# EAGLE design rpi_display_v2 (EAGLE 7.6.0)

## Sheet 1 of 2
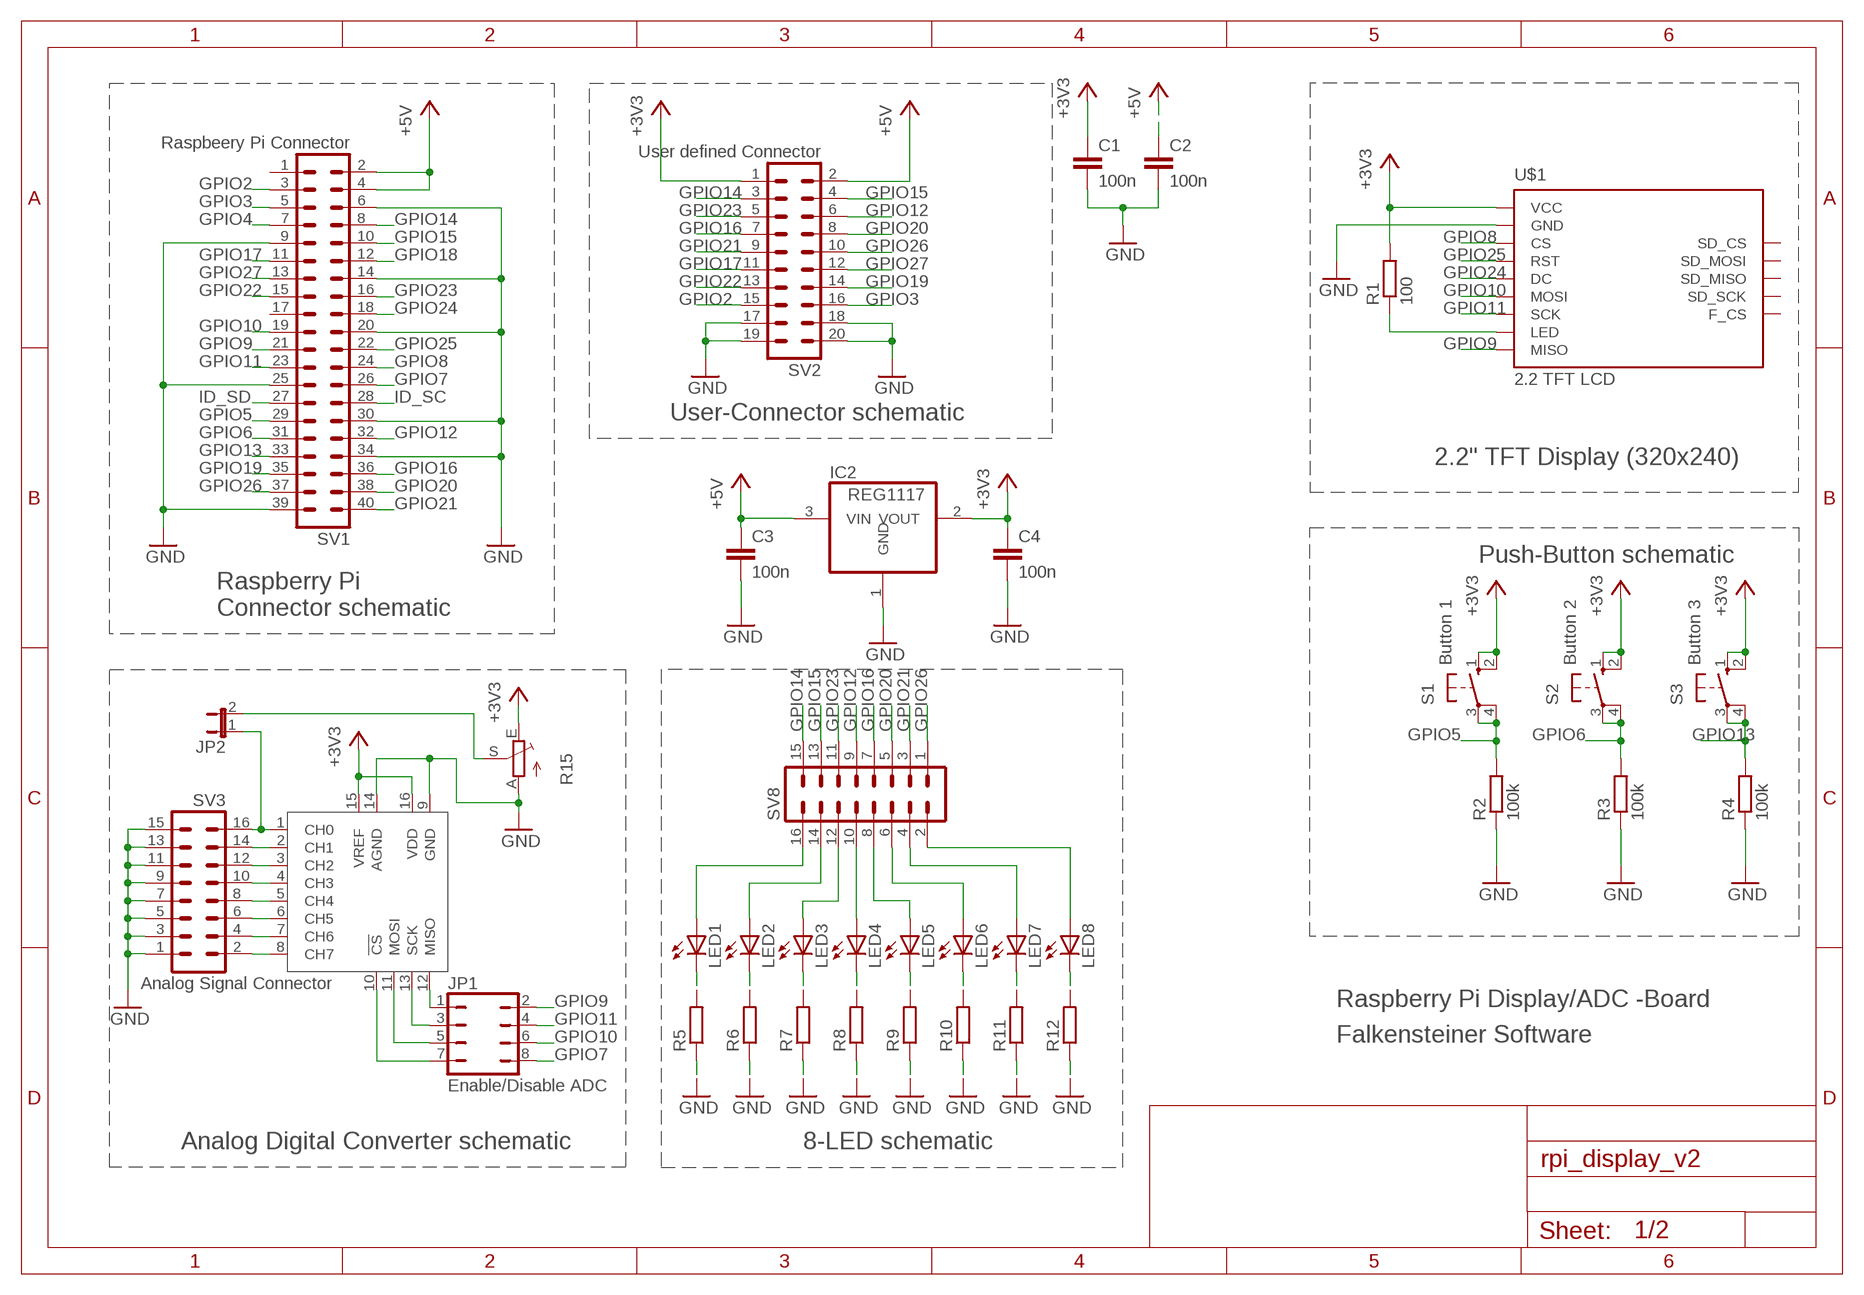
[diagram p0: schematic, sheet 1]

### Parts
C1  100n  C-EUC1206  [C1206]
C2  100n  C-EUC1206  [C1206]
C3  100n  C-EUC1206  [C1206]
C4  100n  C-EUC1206  [C1206]
IC1  MCP3008P  [DIL16]
IC2  REG1117  [SOT223]
JP1  Enable/Disable ADC  JP4Q  [JP4Q]
JP2  JP1E  [JP1]
LED1  LEDSML1206  [SML1206]
LED2  LEDSML1206  [SML1206]
LED3  LEDSML1206  [SML1206]
LED4  LEDSML1206  [SML1206]
LED5  LEDSML1206  [SML1206]
LED6  LEDSML1206  [SML1206]
LED7  LEDSML1206  [SML1206]
LED8  LEDSML1206  [SML1206]
R1  100  R-EU_R1206  [R1206]
R2  100k  R-EU_R1206  [R1206]
R3  100k  R-EU_R1206  [R1206]
R4  100k  R-EU_R1206  [R1206]
R5  R-EU_R1206  [R1206]
R6  R-EU_R1206  [R1206]
R7  R-EU_R1206  [R1206]
R8  R-EU_R1206  [R1206]
R9  R-EU_R1206  [R1206]
R10  R-EU_R1206  [R1206]
R11  R-EU_R1206  [R1206]
R12  R-EU_R1206  [R1206]
R15  TRIM_EU-CA6V  [CA6V]
S1  Button 1  10-XX  [B3F-10XX]
S2  Button 2  10-XX  [B3F-10XX]
S3  Button 3  10-XX  [B3F-10XX]
SV1  Raspbeery Pi Connector  MA20-2  [MA20-2]
SV2  User defined Connector  MA10-2  [MA10-2]
SV3  Analog Signal Connector  MA08-2  [MA08-2]
SV8  MA08-2  [MA08-2]
U$1  2.2_TFT_LCD  [2.2_TFT_LCD]

### Nets
+3V3: C1.1 C4.1 IC1.15(VREF) IC1.16(VDD) IC2.2(VOUT) R1.2 R15.E S1.1(S) S1.2(S1) S2.1(S) S2.2(S1) S3.1(S) S3.2(S1) SV2.1 U$1.VCC ; also sheet 2
+5V: C2.1 C3.1 IC2.3(VIN) SV1.2 SV1.4 SV2.2 ; also sheet 2
GND: C1.2 C2.2 C3.2 C4.2 IC1.9(GND) IC1.14(AGND) IC2.1(GND) R2.1 R3.1 R4.1 R5.1 R6.1 R7.1 R8.1 R9.1 R10.1 R11.1 R12.1 R15.A SV1.6 SV1.9 SV1.14 SV1.20 SV1.25 SV1.30 SV1.34 SV1.39 SV2.17 SV2.18 SV2.19 SV2.20 SV3.1 SV3.3 SV3.5 SV3.7 SV3.9 SV3.11 SV3.13 SV3.15 U$1.GND ; also sheet 2
GPIO2: SV1.3 SV2.15
GPIO3: SV1.5 SV2.16
GPIO4: SV1.7 ; also sheet 2
GPIO5: R2.2 S1.3(P) S1.4(P1) SV1.29
GPIO6: R3.2 S2.3(P) S2.4(P1) SV1.31
GPIO7: JP1.8 SV1.26
GPIO8: SV1.24 U$1.CS
GPIO9: JP1.2 SV1.21 U$1.MISO
GPIO10: JP1.6 SV1.19 U$1.MOSI
GPIO11: JP1.4 SV1.23 U$1.SCK
GPIO12: SV1.32 SV2.6 SV8.9
GPIO13: R4.2 S3.3(P) S3.4(P1) SV1.33
GPIO14: SV1.8 SV2.3 SV8.15
GPIO15: SV1.10 SV2.4 SV8.13
GPIO16: SV1.36 SV2.7 SV8.7
GPIO17: SV1.11 SV2.11 ; also sheet 2
GPIO18: SV1.12 ; also sheet 2
GPIO19: SV1.35 SV2.14
GPIO20: SV1.38 SV2.8 SV8.5
GPIO21: SV1.40 SV2.9 SV8.3
GPIO22: SV1.15 SV2.13 ; also sheet 2
GPIO23: SV1.16 SV2.5 SV8.11
GPIO24: SV1.18 U$1.DC
GPIO25: SV1.22 U$1.RST
GPIO26: SV1.37 SV2.10 SV8.1
GPIO27: SV1.13 SV2.12 ; also sheet 2
ID_SC: SV1.28
ID_SD: SV1.27
N$1: R1.1 U$1.LED
N$2: IC1.12(MISO) JP1.1
N$3: IC1.13(SCK) JP1.3
N$4: IC1.11(MOSI) JP1.5
N$5: IC1.10(!CS) JP1.7
N$6: IC1.1(CH0) JP2.1 SV3.16
N$7: IC1.2(CH1) SV3.14
N$8: IC1.3(CH2) SV3.12
N$9: IC1.4(CH3) SV3.10
N$10: IC1.5(CH4) SV3.8
N$11: IC1.6(CH5) SV3.6
N$12: IC1.7(CH6) SV3.4
N$13: IC1.8(CH7) SV3.2
N$14: LED1.A SV8.16
N$15: LED1.C R5.2
N$16: LED2.A SV8.14
N$17: LED2.C R6.2
N$18: LED3.A SV8.12
N$19: LED3.C R7.2
N$20: LED4.A SV8.10
N$21: LED4.C R8.2
N$22: LED5.A SV8.8
N$23: LED5.C R9.2
N$24: LED6.A SV8.6
N$25: LED6.C R10.2
N$26: LED7.A SV8.4
N$27: LED7.C R11.2
N$28: LED8.A SV8.2
N$29: LED8.C R12.2
N$65: JP2.2 R15.S
Unconnected: SV1.1 SV1.17 U$1.F_CS U$1.SD_CS U$1.SD_MISO U$1.SD_MOSI U$1.SD_SCK

### Notes on the sheet
- User-Connector schematic
- 2.2" TFT Display (320x240)
- Push-Button schematic
- Raspberry Pi
  Connector schematic
- Raspberry Pi Display/ADC -Board
- Falkensteiner Software
- Analog Digital Converter schematic | 8-LED schematic

## Sheet 2 of 2
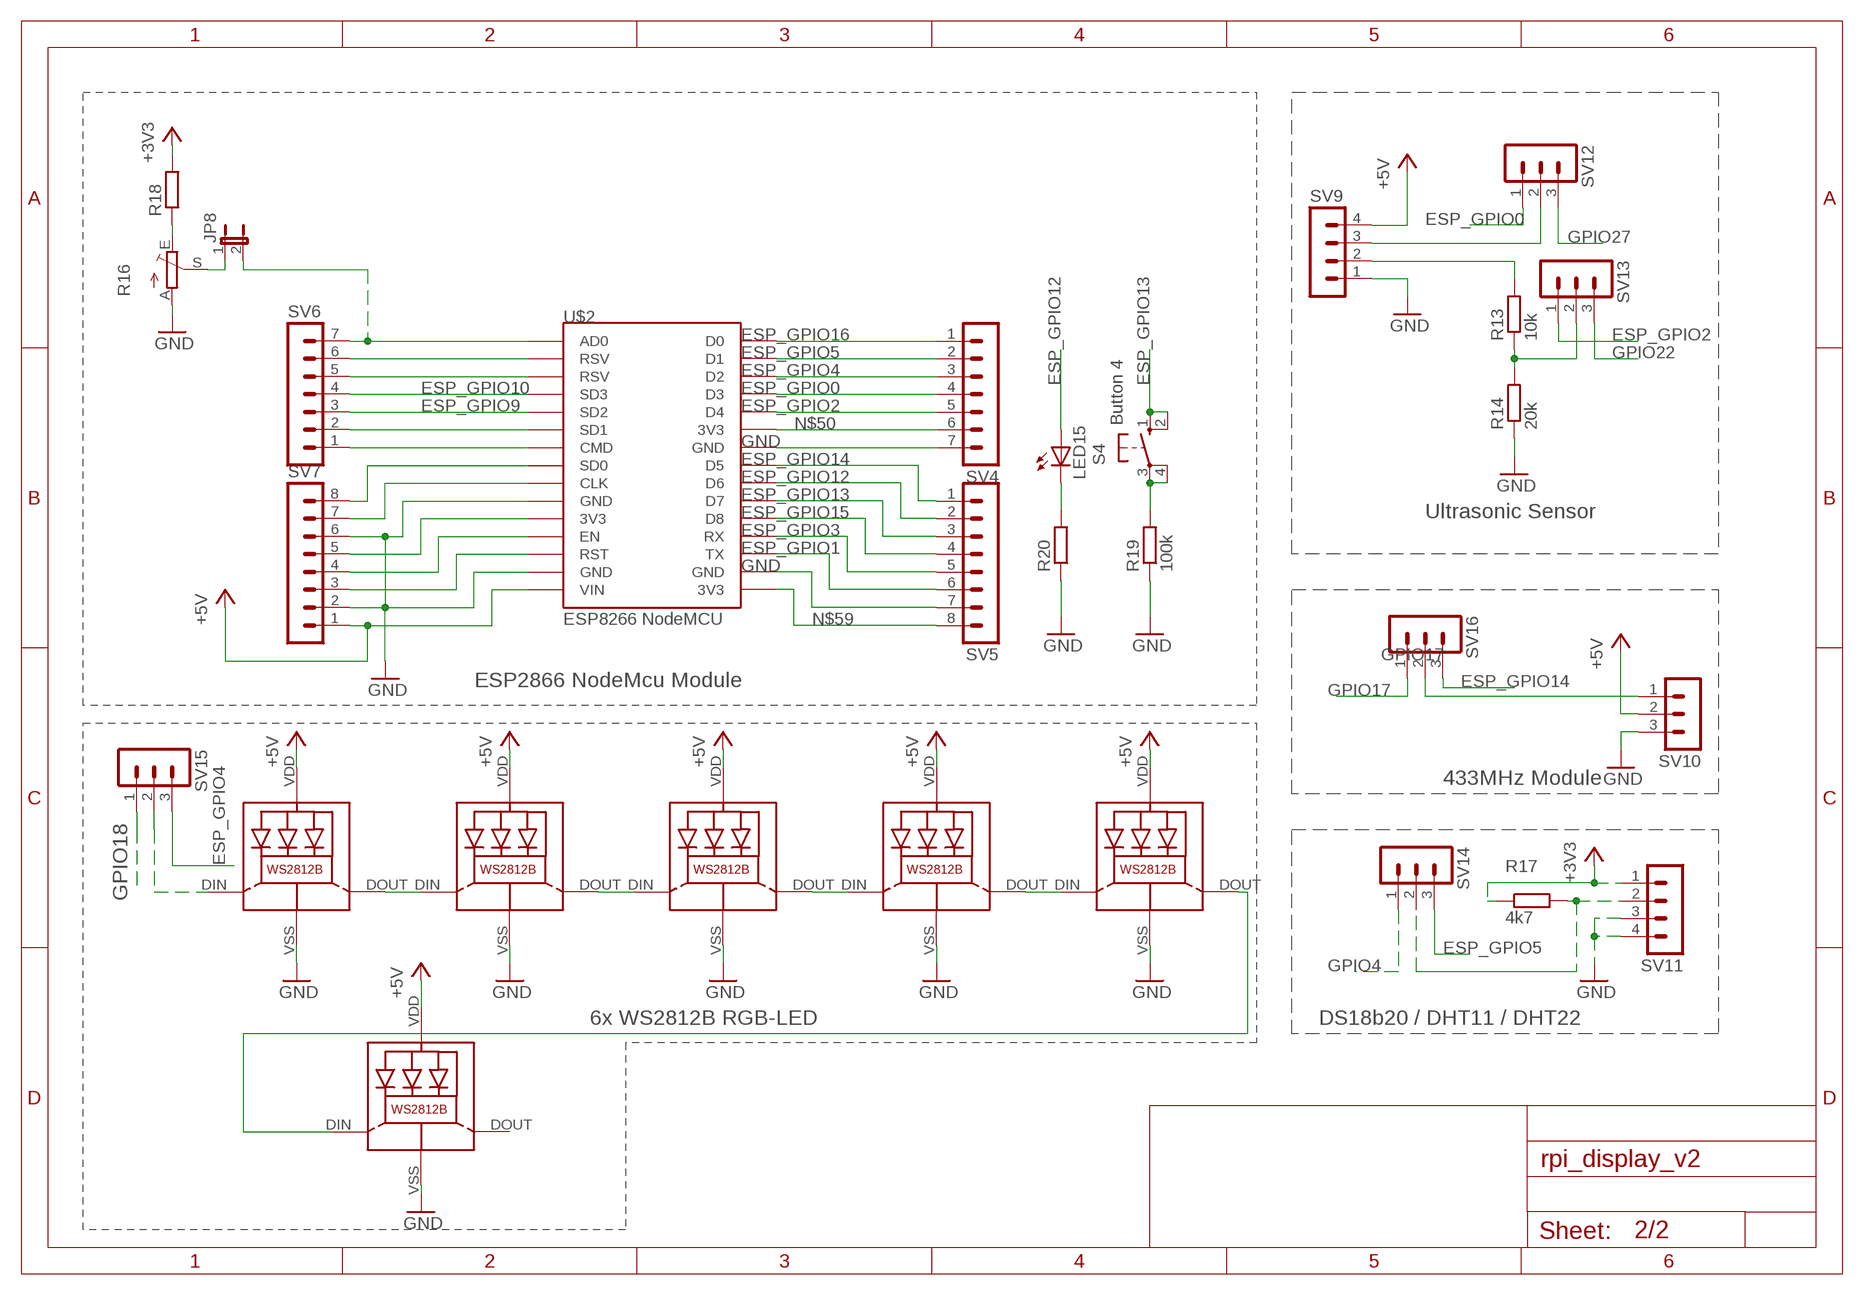
[diagram p1: schematic, sheet 2]

### Parts
JP8  JP1E  [JP1]
LED9  WS2812B  [WS2812B]
LED10  WS2812B  [WS2812B]
LED11  WS2812B  [WS2812B]
LED12  WS2812B  [WS2812B]
LED13  WS2812B  [WS2812B]
LED14  WS2812B  [WS2812B]
LED15  LEDSML1206  [SML1206]
R13  10k  R-EU_R1206  [R1206]
R14  20k  R-EU_R1206  [R1206]
R16  TRIM_EU-CA6V  [CA6V]
R17  4k7  R-EU_R1206  [R1206]
R18  R-EU_R1206  [R1206]
R19  100k  R-EU_R1206  [R1206]
R20  R-EU_R1206  [R1206]
S4  Button 4  10-XX  [B3F-10XX]
SV4  MA07-1  [MA07-1]
SV5  MA08-1  [MA08-1]
SV6  MA07-1  [MA07-1]
SV7  MA08-1  [MA08-1]
SV9  MA04-1  [MA04-1]
SV10  MA03-1  [MA03-1]
SV11  MA04-1  [MA04-1]
SV12  MA03-1  [MA03-1]
SV13  MA03-1  [MA03-1]
SV14  MA03-1  [MA03-1]
SV15  MA03-1  [MA03-1]
SV16  MA03-1  [MA03-1]
U$2  ESP8266 NodeMCU  ESP12E_DEVKIT  [ESP12E_DEVKIT]

### Nets
+3V3: R17.1 R18.2 SV11.1 ; also sheet 1
+5V: LED9.VDD LED10.VDD LED11.VDD LED12.VDD LED13.VDD LED14.VDD SV7.1 SV9.4 SV10.2 U$2.VIN ; also sheet 1
ESP_GPIO0: SV4.4 SV12.1 U$2.D3
ESP_GPIO1: SV5.6 U$2.TX
ESP_GPIO2: SV4.5 SV13.1 U$2.D4
ESP_GPIO3: SV5.5 U$2.RX
ESP_GPIO4: SV4.3 SV15.3 U$2.D2
ESP_GPIO5: SV4.2 SV14.3 U$2.D1
ESP_GPIO9: SV6.3 U$2.SD2
ESP_GPIO10: SV6.4 U$2.SD3
ESP_GPIO12: LED15.A SV5.2 U$2.D6
ESP_GPIO13: S4.1(S) S4.2(S1) SV5.3 U$2.D7
ESP_GPIO14: SV5.1 SV16.3 U$2.D5
ESP_GPIO15: SV5.4 U$2.D8
ESP_GPIO16: SV4.1 U$2.D0
GND: LED9.VSS(GND) LED10.VSS(GND) LED11.VSS(GND) LED12.VSS(GND) LED13.VSS(GND) LED14.VSS(GND) R14.1 R16.A R19.1 R20.1 SV4.7 SV5.7 SV7.2 SV7.6 SV9.1 SV10.3 SV11.3 SV11.4 U$2.GND@0(GND) U$2.GND@1(GND) U$2.GND@2(GND) U$2.GND@3(GND) ; also sheet 1
GPIO4: SV14.1 ; also sheet 1
GPIO17: SV16.1 ; also sheet 1
GPIO18: SV15.1 ; also sheet 1
GPIO22: SV13.3 ; also sheet 1
GPIO27: SV12.3 ; also sheet 1
N$30: JP8.2 SV6.7 U$2.AD0
N$31: SV6.6 U$2.RSV@0(RSV)
N$32: SV6.5 U$2.RSV@1(RSV)
N$33: LED15.C R20.2
N$34: R19.2 S4.3(P) S4.4(P1)
N$35: SV6.2 U$2.SD1
N$36: SV6.1 U$2.CMD
N$37: SV7.8 U$2.SD0
N$38: SV7.7 U$2.CLK
N$39: LED13.DOUT(DO) LED14.DIN(DI)
N$40: SV7.5 U$2.3V3@0(3V3)
N$41: SV7.4 U$2.EN
N$42: SV7.3 U$2.RST
N$43: LED9.DOUT(DO) LED10.DIN(DI)
N$44: LED10.DOUT(DO) LED11.DIN(DI)
N$50: SV4.6 U$2.3V3@1(3V3)
N$59: SV5.8 U$2.3V3@2(3V3)
N$60: LED11.DOUT(DO) LED12.DIN(DI)
N$61: LED12.DOUT(DO) LED13.DIN(DI)
N$62: R13.1 R14.2 SV13.2
N$63: R13.2 SV9.2
N$64: SV9.3 SV12.2
N$66: SV10.1 SV16.2
N$67: LED9.DIN(DI) SV15.2
N$68: R17.2 SV11.2 SV14.2
N$69: R16.E R18.1
N$70: JP8.1 R16.S
Unconnected: LED14.DOUT(DO)

### Notes on the sheet
- Ultrasonic Sensor
- ESP2866 NodeMcu Module
- 433MHz Module
- 6x WS2812B RGB-LED | DS18b20 / DHT11 / DHT22

## Library data of the parts
C1-C4 = rcl:C-EU: CAPACITOR, European symbol
IC1 = MCP3008:MCP3008
IC2 = burr-brown:REG1117: 800mA and 1A Low Dropout (LDO) Positive Regulator 1.8V, 2.5V, 2.85V, 3.3V, 5V, and Adj; MPN: REG1117; OC_FARNELL: 1097566; OC_NEWARK: 14P6981
JP1 = jumper:JP4Q: JUMPER
JP2 JP8 = jumper:JP1E: JUMPER
LED1-LED8 LED15 = led:LED: LED OSRAM: - CHIPLED LG R971, LG N971, LY N971, LG Q971, LY Q971, LO R971, LY R971 LH N974, LH R974 LS Q976, LO Q976, LY Q976 LO Q996 - Hyper CHIPLED LW Q18S LB Q993, LB Q99A, LB R99A - SideLED LS A670, LO A670, LY A670, LG A670, LP A670 LB A673, LV A673, LT A673, LW A673 LH A674 LY A675 LS A676, LA A676, LO A676, LY A676, LW A676 LS A679, LY A679, LG A679 - Hyper Micro SIDELED® LS Y876, LA Y876, LO Y876, LY Y876 LT Y87S - SmartLED LW L88C, LW L88S LB L89C, LB L89S, LG L890 LS L89K, LO L89K, LY L89K LS L896, LA L896, LO L896, LY L896 - TOPLED LS T670, LO T670, LY T670, LG T670, LP T670 LSG T670, LSP T670, LSY T670, LOP T670, LYG T670 LG T671, LOG T671, LSG T671 LB T673, LV T673, LT T673, LW T673 LH T674 LS T676, LA T676, LO T676, LY T676, LB T676, LH T676, LSB T676, LW T676 LB T67C, LV T67C, LT T67C, LS T67K, LO T67K, LY T67K, LW E67C LS E67B, LA E67B, LO E67B, LY E67B, LB E67C, LV E67C, LT E67C LW T67C LS T679, LY T679, LG T679 LS T770, LO T770, LY T770, LG T770, LP T770 LB T773, LV T773, LT T773, LW T773 LH T774 LS E675, LA E675, LY E675, LS T675 LS T776, LA T776, LO T776, LY T776, LB T776 LHGB T686 LT T68C, LB T68C - Hyper Mini TOPLED® LB M676 - Mini TOPLED Santana® LG M470 LS M47K, LO M47K, LY M47K Source: http://www.osram.convergy.de LUXEON: - LUMILED® LXK2-PW12-R00, LXK2-PW12-S00, LXK2-PW14-U00, LXK2-PW14-V00 LXK2-PM12-R00, LXK2-PM12-S00, LXK2-PM14-U00 LXK2-PE12-Q00, LXK2-PE12-R00, LXK2-PE12-S00, LXK2-PE14-T00, LXK2-PE14-U00 LXK2-PB12-K00, LXK2-PB12-L00, LXK2-PB12-M00, LXK2-PB14-N00, LXK2-PB14-P00, LXK2-PB14-Q00 LXK2-PR12-L00, LXK2-PR12-M00, LXK2-PR14-Q00, LXK2-PR14-R00 LXK2-PD12-Q00, LXK2-PD12-R00, LXK2-PD12-S00 LXK2-PH12-R00, LXK2-PH12-S00 LXK2-PL12-P00, LXK2-PL12-Q00, LXK2-PL12-R00 Source: www.luxeon.com KINGBRIGHT: KA-3528ASYC Source: www.kingbright.com
LED9-LED14 = WS2812B:WS2812B: Features and Benefits  * Intelligent reverse connect protection, the power supply reverse connection does not damage the IC. * The control circuit and the LED share the only power source. Control circuit and RGB chip are integrated in a package of 5050 components, form a complete control of pixel point.  * Built-in signal reshaping circuit, after wave reshaping to the next driver, ensure wave-form distortion not accumulate.  * Built-in electric reset circuit and power lost reset circuit.  * Each pixel of the three primary color can achieve 256 brightness display, completed 16777216 color full color display, and scan frequency not less than 400Hz/s.  * Cascading port transmission signal by single line.  * Any two point the distance more than 5m transmission signal without any increase circuit.  * When the refresh rate is 30fps, cascade number are not less than1024 points.  * Send data at speeds of 800Kbps.  *The color of the light were highly consistent, cost-effective. Applications  Full-color module, Full color soft lights a lamp strip. LED decorative lighting, Indoor/outdoor LED video irregular screen. General description WS2812B is a intelligent control LED light source that the control circuit and RGB chip are integrated in a package of 5050 components. It internal include intelligent digital port data latch and signal reshaping amplification drive circuit. Also include a precision internal oscillator and a 12V voltage programmable constant curre-nt control part, effectively ensuring the pixel point light color height consistent. The data transfer protocol use single NZR communication mode. After the pixel power-on reset, the DIN port receive data from controller, the first pixel collect initial 24bit data then sent to the internal data latch, the other data which reshaping by the internal signal reshaping amplification circuit sent to the next cascade pixel through the DO port. After transmission for each pixel,the signal to reduce 24bit. pixel adopt auto reshaping transmit technology, making the pixel cascade number is not limited the signal transmission, only depend on the speed of signal transmission. LED with low driving voltage, environmental protection and energy saving, high brightness, scattering angle is large, good consistency, low power, long life and other advantages. The control chip integrated in LED above becoming more simple circuit, small volume, convenient installation. Absolute Maximum Ratings Power supply voltage: VDD +3.5V..+5.3V Input voltage: VI -0.5V..VDD+0.5V based on WS2812 from https://github.com/adafruit/Adafruit-Eagle-Library
R1-R14 R17-R20 = rcl:R-EU_: RESISTOR, European symbol
R15 R16 = pot:TRIM_EU-: POTENTIOMETER
S1-S4 = switch-omron:10-XX: OMRON SWITCH; MPN: B3F-1000; OC_FARNELL: 176432; OC_NEWARK: 36M3542
SV1 = con-lstb:MA20-2: PIN HEADER; OC_FARNELL: unknown; OC_NEWARK: unknown
SV2 = con-lstb:MA10-2: PIN HEADER; OC_FARNELL: unknown; OC_NEWARK: unknown
SV3 SV8 = con-lstb:MA08-2: PIN HEADER; OC_FARNELL: unknown; OC_NEWARK: unknown
SV4 SV6 = con-lstb:MA07-1: PIN HEADER; OC_FARNELL: unknown; OC_NEWARK: unknown
SV5 SV7 = con-lstb:MA08-1: PIN HEADER; OC_FARNELL: unknown; OC_NEWARK: unknown
SV9 SV11 = con-lstb:MA04-1: PIN HEADER; OC_FARNELL: unknown; OC_NEWARK: unknown
SV10 SV12-SV16 = con-lstb:MA03-1: PIN HEADER; OC_FARNELL: unknown; OC_NEWARK: unknown
U$1 = Aldar:2.2_TFT_LCD
U$2 = ESP12E_DEVKIT:ESP12E_DEVKIT: ESP12E DEVKIT BOARD

## Board
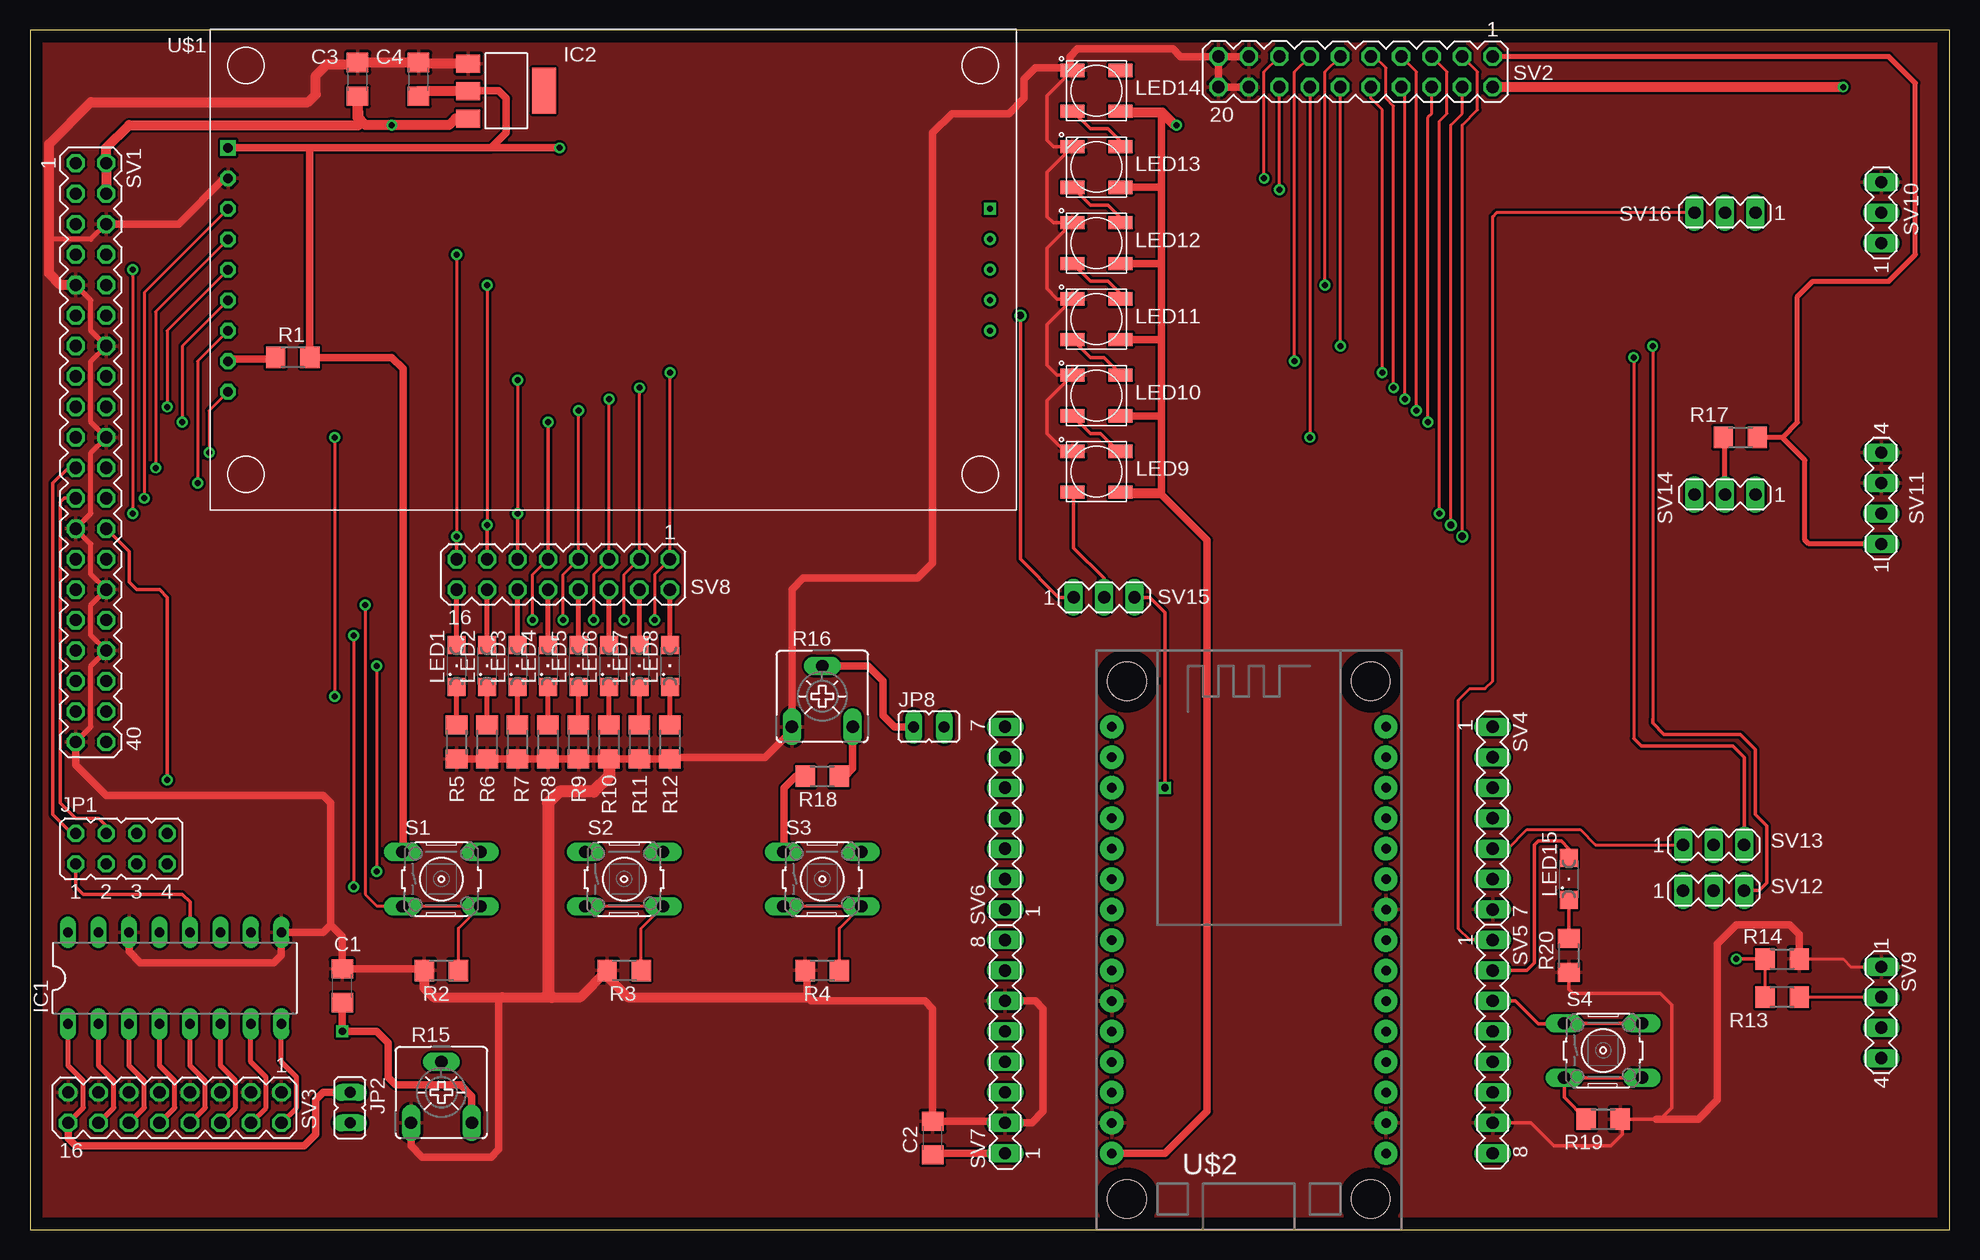
[diagram p2: board, top side]
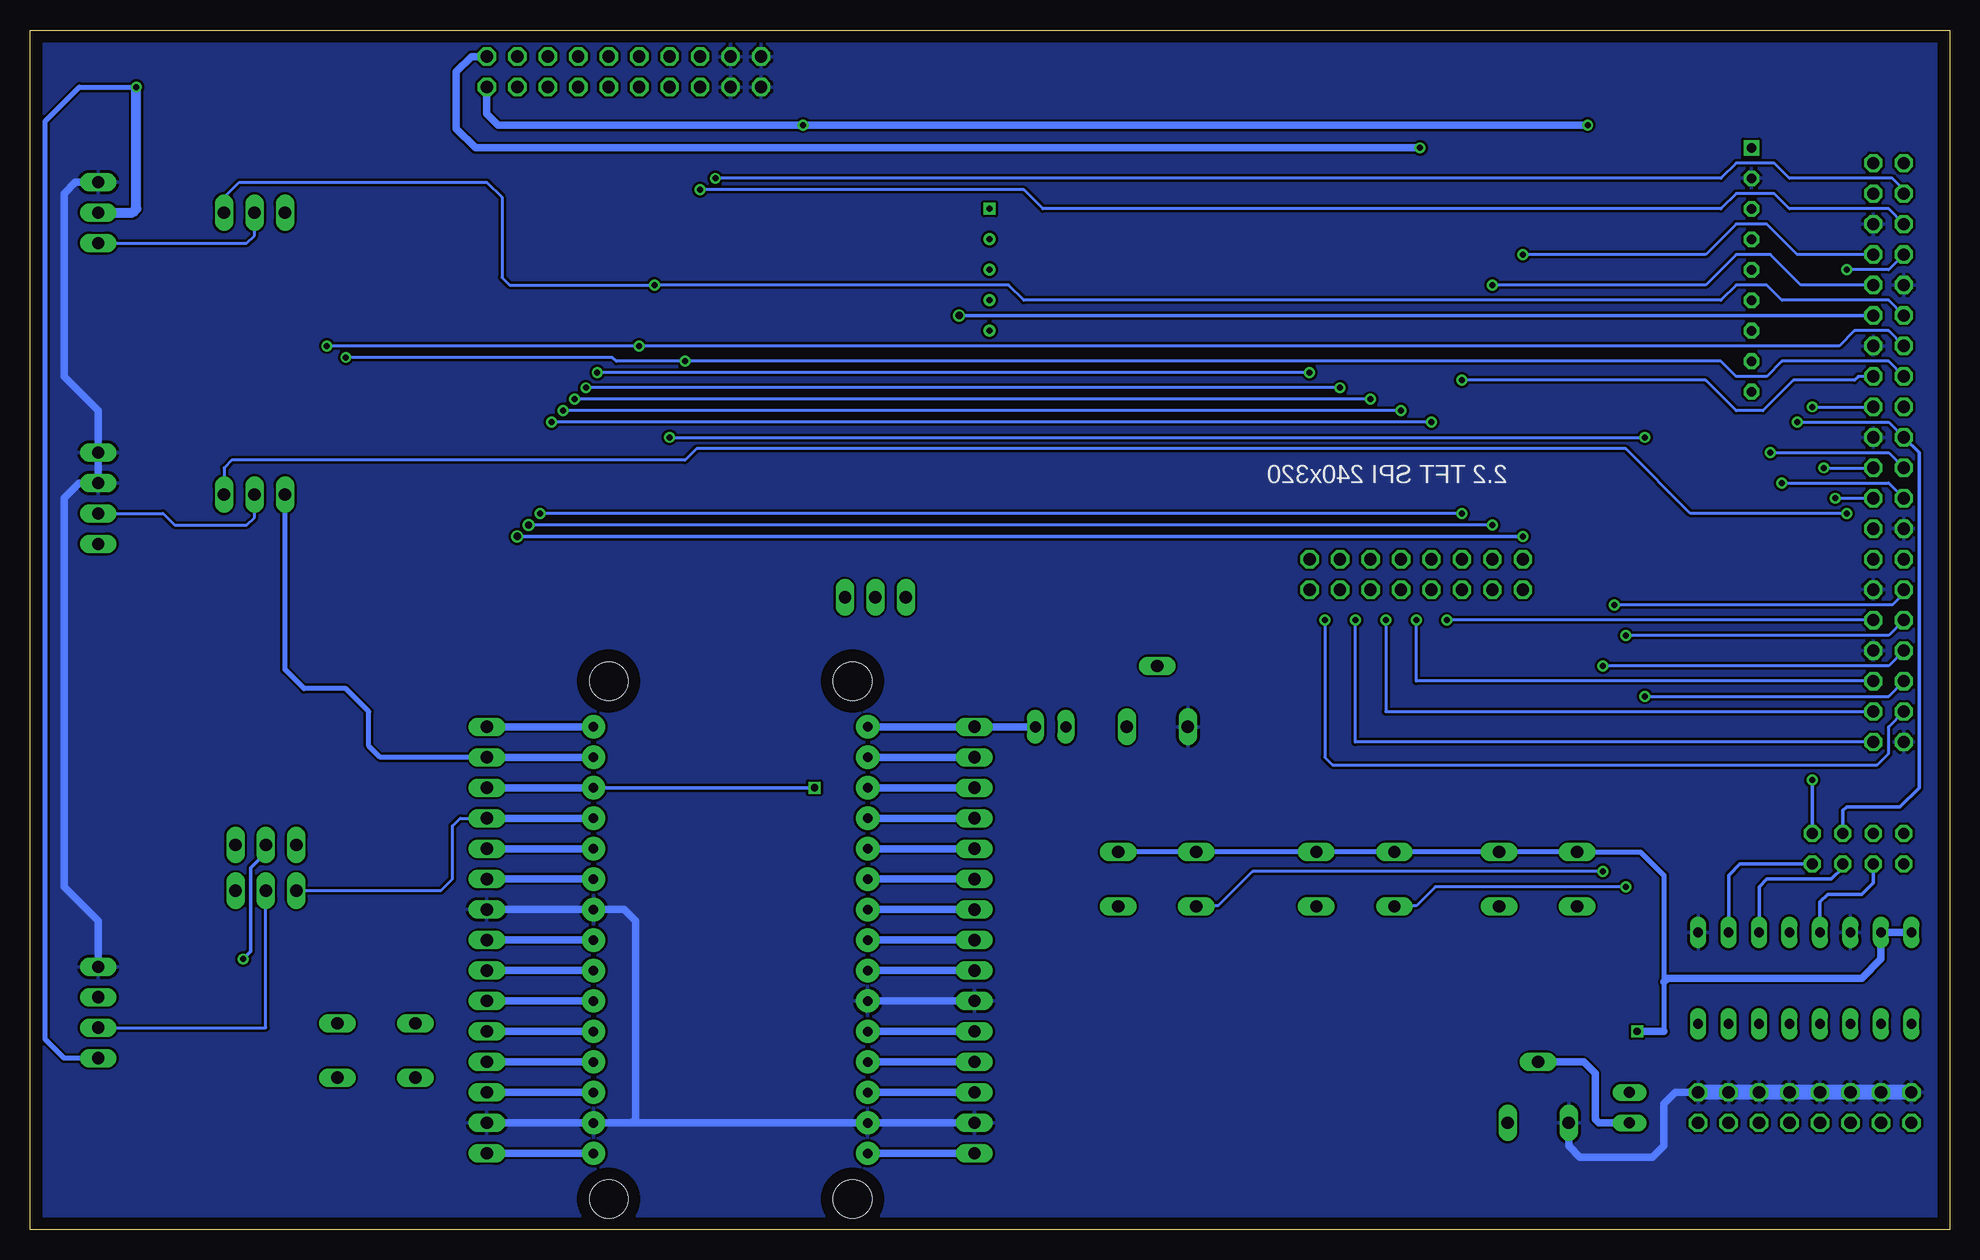
[diagram p3: board, bottom side, seen from below]

Size 160 x 100 mm. Coordinates in mm from the lower left corner, seen from the top.
Outline: 0,0 160,0 160,100 0,100 0,0
Copper layers (1*16): Top 0.035mm / dielectric 1.5mm / Bottom 0.035mm
Design rules "PCBway": minimum track width 6mil, minimum drill 0.3mm, track to track 0.205mm, track to pad 0.205mm, pad to pad 0.205mm, via to via 0.205mm, smd to smd 8mil, copper to edge 40mil, drill to drill 8mil, minimum pad ring 10mil, minimum via ring 8mil, stop-mask expansion 4mil, vias tented up to drill 25mil, thermal gap 10mil

### Footprints (pad centres in the part's own frame; a part is rotated, then mirrored left to right if it is on the bottom)
C1206 = smd 1.6 x 1.8: 1 -1.4,0; 2 1.4,0
DIL16 = drill 0.813 long: 1 -8.89,-3.81; 2 -6.35,-3.81; 3 -3.81,-3.81; 4 -1.27,-3.81; 5 1.27,-3.81; 6 3.81,-3.81; 7 6.35,-3.81; 8 8.89,-3.81; 9 8.89,3.81; 10 6.35,3.81; 11 3.81,3.81; 12 1.27,3.81; 13 -1.27,3.81; 14 -3.81,3.81; 15 -6.35,3.81; 16 -8.89,3.81
SOT223 = smd 1.499 x 2.007: 1 -2.261,-3.15; 2 0.025,-3.15; 3 2.311,-3.15 | smd 3.81 x 2.007: 4 0,3.15
JP4Q = drill 0.914 octagon: 1 -3.81,-1.27; 2 -3.81,1.27; 3 -1.27,-1.27; 4 -1.27,1.27; 5 1.27,-1.27; 6 1.27,1.27; 7 3.81,-1.27; 8 3.81,1.27
JP1 = drill 0.914 long: 1 0,-1.27; 2 0,1.27
SML1206 = smd 1.5 x 1.5: A 1.75,0; C -1.75,0
WS2812B = smd 2 x 1.1: DIN 2,1.7; DOUT -2,-1.7; VDD -2,1.7; VSS 2,-1.7
R1206 = smd 1.6 x 1.803: 1 -1.422,0; 2 1.422,0
CA6V = drill 1.016 long: A -2.54,-2.54; E 2.54,-2.54; S 0,2.54
B3F-10XX = drill 1.016 long: 1 -3.251,2.261; 2 3.251,2.261; 3 -3.251,-2.261; 4 3.251,-2.261
MA20-2 = drill 1.016 octagon: 1 -24.13,-1.27; 2 -24.13,1.27; 3 -21.59,-1.27; 4 -21.59,1.27; 5 -19.05,-1.27; 6 -19.05,1.27; 7 -16.51,-1.27; 8 -16.51,1.27; 9 -13.97,-1.27; 10 -13.97,1.27; 11 -11.43,-1.27; 12 -11.43,1.27; 13 -8.89,-1.27; 14 -8.89,1.27; 15 -6.35,-1.27; 16 -6.35,1.27; 17 -3.81,-1.27; 18 -3.81,1.27; 19 -1.27,-1.27; 20 -1.27,1.27; 21 1.27,-1.27; 22 1.27,1.27; 23 3.81,-1.27; 24 3.81,1.27; 25 6.35,-1.27; 26 6.35,1.27; 27 8.89,-1.27; 28 8.89,1.27; 29 11.43,-1.27; 30 11.43,1.27; 31 13.97,-1.27; 32 13.97,1.27; 33 16.51,-1.27; 34 16.51,1.27; 35 19.05,-1.27; 36 19.05,1.27; 37 21.59,-1.27; 38 21.59,1.27; 39 24.13,-1.27; 40 24.13,1.27
MA10-2 = drill 1.016 octagon: 1 -11.43,-1.27; 2 -11.43,1.27; 3 -8.89,-1.27; 4 -8.89,1.27; 5 -6.35,-1.27; 6 -6.35,1.27; 7 -3.81,-1.27; 8 -3.81,1.27; 9 -1.27,-1.27; 10 -1.27,1.27; 11 1.27,-1.27; 12 1.27,1.27; 13 3.81,-1.27; 14 3.81,1.27; 15 6.35,-1.27; 16 6.35,1.27; 17 8.89,-1.27; 18 8.89,1.27; 19 11.43,-1.27; 20 11.43,1.27
MA08-2 = drill 1.016 octagon: 1 -8.89,-1.27; 2 -8.89,1.27; 3 -6.35,-1.27; 4 -6.35,1.27; 5 -3.81,-1.27; 6 -3.81,1.27; 7 -1.27,-1.27; 8 -1.27,1.27; 9 1.27,-1.27; 10 1.27,1.27; 11 3.81,-1.27; 12 3.81,1.27; 13 6.35,-1.27; 14 6.35,1.27; 15 8.89,-1.27; 16 8.89,1.27
MA07-1 = drill 1.016 long: 1 -7.62,0; 2 -5.08,0; 3 -2.54,0; 4 0,0; 5 2.54,0; 6 5.08,0; 7 7.62,0
MA08-1 = drill 1.016 long: 1 -8.89,0; 2 -6.35,0; 3 -3.81,0; 4 -1.27,0; 5 1.27,0; 6 3.81,0; 7 6.35,0; 8 8.89,0
MA04-1 = drill 1.016 long: 1 -3.81,0; 2 -1.27,0; 3 1.27,0; 4 3.81,0
MA03-1 = drill 1.016 long: 1 -2.54,0; 2 0,0; 3 2.54,0
2.2_TFT_LCD = drill 0.8 octagon: CS 0,-5.08; DC 0,-10.16; GND 0,-2.54; LED 0,-17.78; MISO 0,-20.32; MOSI 0,-12.7; RST 0,-7.62; SCK 0,-15.24 | drill 0.5: F_CS 63.5,-15.24; SD_MISO 63.5,-10.16; SD_MOSI 63.5,-7.62; SD_SCK 63.5,-12.7 | drill 0.5 square: SD_CS 63.5,-5.08 | drill 0.8 square: VCC 0,0
ESP12E_DEVKIT = drill 0.8 pad 1.93: 3V3@0 -11.43,-7.62; 3V3@1 11.43,5.08; 3V3@2 11.43,-17.78; AD0 -11.43,17.78; CLK -11.43,-2.54; CMD -11.43,2.54; D0 11.43,17.78; D1 11.43,15.24; D2 11.43,12.7; D3 11.43,10.16; D4 11.43,7.62; D5 11.43,0; D6 11.43,-2.54; D7 11.43,-5.08; D8 11.43,-7.62; EN -11.43,-10.16; GND@0 -11.43,-5.08; GND@1 -11.43,-15.24; GND@2 11.43,2.54; GND@3 11.43,-15.24; RST -11.43,-12.7; RSV@0 -11.43,15.24; RSV@1 -11.43,12.7; RX 11.43,-10.16; SD0 -11.43,0; SD1 -11.43,5.08; SD2 -11.43,7.62; SD3 -11.43,10.16; TX 11.43,-12.7; VIN -11.43,-17.78 | hole 3.2: -10.16,21.59; 10.16,21.59; 10.16,-21.59; -10.16,-21.59

### Placement (x,y rotation side)
C1  26.04,20.32 90 top
C2  75.25,7.62 90 top
C3  27.3,95.89 90 top
C4  32.38,95.89 90 top
IC1  12.06,20.95 0 top
IC2  39.69,94.93 270 top
JP1  7.62,31.75 0 top
JP2  26.67,10.16 180 top
JP8  74.93,41.91 270 top
LED1  35.56,46.99 90 top
LED2  38.1,46.99 90 top
LED3  40.64,46.99 90 top
LED4  43.18,46.99 90 top
LED5  45.72,46.99 90 top
LED6  48.26,46.99 90 top
LED7  50.8,46.99 90 top
LED8  53.34,46.99 90 top
LED9  88.9,63.18 180 top
LED10  88.9,69.53 180 top
LED11  88.9,75.88 180 top
LED12  88.9,82.23 180 top
LED13  88.9,88.58 180 top
LED14  88.9,94.93 180 top
LED15  128.27,29.21 90 top
R1  21.91,72.71 0 top
R2  34.29,21.59 0 top
R3  49.53,21.59 0 top
R4  66.04,21.59 0 top
R5  35.56,40.64 90 top
R6  38.1,40.64 90 top
R7  40.64,40.64 90 top
R8  43.18,40.64 90 top
R9  45.72,40.64 90 top
R10  48.26,40.64 90 top
R11  50.8,40.64 90 top
R12  53.34,40.64 90 top
R13  146.05,19.37 0 top
R14  146.05,22.54 180 top
R15  34.29,11.43 0 top
R16  66.04,44.45 0 top
R17  142.56,66.04 180 top
R18  66.04,37.78 180 top
R19  131.13,9.21 180 top
R20  128.27,22.86 90 top
S1  34.29,29.21 0 top
S2  49.53,29.21 0 top
S3  66.04,29.21 0 top
S4  131.13,14.92 0 top
SV1  5.08,64.77 270 top
SV2  110.49,96.52 180 top
SV3  12.06,10.16 180 top
SV4  121.92,34.29 270 top
SV5  121.92,15.24 270 top
SV6  81.28,34.29 90 top
SV7  81.28,15.24 90 top
SV8  44.45,54.61 180 top
SV9  154.31,18.1 270 top
SV10  154.31,84.77 90 top
SV11  154.31,60.96 90 top
SV12  140.34,28.26 0 top
SV13  140.34,32.07 0 top
SV14  141.29,61.28 180 top
SV15  89.53,52.7 0 top
SV16  141.29,84.77 180 top
U$1  16.51,90.17 0 top
U$2  101.6,24.13 0 top

### Tracks (layer width: path | path; a pad name or v marks a point on that pad's centre or on a via)
+3V3  (via drill 0.5, 0.6)
  Top 0.254: 31.11,31.55 S1.1
  Top 0.406: 69.22,31.55 S3.2 | 146.05,66.04 147.32,67.31 147.32,77.79 148.59,79.06 154.94,79.06 157.16,81.28 157.16,95.57 154.94,97.79 SV2.1 | 146.05,66.04 R17.1 | SV11.1 148.27,57.15 147.96,57.47 147.96,64.14 146.05,66.04
  Top 0.61: C1.1 v26.04,16.51 28.89,16.51 29.84,15.56 29.84,12.7 30.48,12.06 35.88,12.06 36.83,11.11 R15.E | U$1.VCC 23.5,90.17 | 23.5,90.17 38.42,90.17 | 38.42,90.17 39.69,91.44 39.69,94.3 39.05,94.93 36.56,94.93 IC2.2 | 23.5,90.17 23.33,90 R1.2 30.16,72.71 31.11,71.75 31.11,31.55 | v44.13,90.17 38.42,90.17 | R18.2 63.82,37.78 62.87,36.83 62.87,31.55 S3.1
  Top 0.813: IC2.2 32.38,94.91 C4.1 | SV2.1 121.92,98.11
  Bottom 0.406: S3.2 S3.1 S2.2 S2.1 S1.2 S1.1 25.76,31.47 23.81,29.53 23.81,20.64 23.81,16.51
  Bottom 0.61: v26.04,16.51 23.81,16.51 | SV2.1 123.19,97.79 124.46,96.52 124.46,91.76 122.87,90.17 v44.13,90.17 | IC1.16 IC1.15 5.71,22.54 7.3,20.95 23.5,20.95 23.81,20.64
+5V  (via drill 0.5)
  Top 0.305: LED14.VDD 91.44,93.23 92.19,93.23 | LED13.VDD 90.92,86.88 | LED12.VDD 91.87,80.53
  Top 0.61: SV7.1 75.38,6.35 C2.1 | U$2.VIN 94.61,6.35 98.11,9.84 98.11,57.47 94.3,61.28 | 94.3,61.28 91.11,61.28 LED9.VDD 94.09,61.48 94.3,61.28 | 94.46,92.87 95.25,92.08 v95.57,92.08 94.41,93.23 LED14.VDD | 94.46,92.87 94.3,93.03 91.64,93.03 91.44,93.23 | 94.3,61.28 94.3,67.94 | 94.3,67.94 94.3,74.3 | 94.3,74.3 94.3,80.64 | 94.3,80.64 94.3,87 | 94.3,87 94.3,92.71 94.46,92.87 | LED10.VDD 94.19,67.83 94.3,67.94 | LED11.VDD 94.19,74.18 94.3,74.3 | LED12.VDD 94.19,80.53 94.3,80.64 | LED13.VDD 94.19,86.88 94.3,87
  Top 0.813: IC2.3 35.47,92.62 34.92,92.08 v30.16,92.08 27.94,92.08 27.3,92.71 C3.1 27.43,92.08 8.26,92.08 6.35,90.17 SV1.2 SV1.4 | v151.13,95.25 SV2.2
  Bottom 0.406: SV9.4 157.16,14.29 158.75,15.88 158.75,92.39 155.89,95.25 v151.13,95.25
  Bottom 0.61: SV7.1 U$2.VIN | SV2.2 121.92,93.03 120.97,92.08 v95.57,92.08 v30.16,92.08
  Bottom 0.813: SV10.2 151.45,84.77 151.13,85.09 v151.13,95.25
ESP_GPIO0
  Bottom 0.254: SV12.1 125.73,28.26 124.78,29.21 124.78,33.66 124.14,34.29 SV4.4
  Bottom 0.61: U$2.D3 SV4.4
ESP_GPIO1
  Bottom 0.61: U$2.TX SV5.6
ESP_GPIO2
  Top 0.254: SV4.5 123.19,31.75 124.78,33.34 129.22,33.34 130.49,32.07 SV13.1
  Bottom 0.61: U$2.D4 SV4.5
ESP_GPIO3
  Bottom 0.61: U$2.RX SV5.5
ESP_GPIO4  (via drill 0.6)
  Top 0.305: SV15.3 93.34,52.7 94.61,51.44 v94.61,36.83
  Bottom 0.305: v94.61,36.83 U$2.D2
  Bottom 0.61: U$2.D2 SV4.3
ESP_GPIO5
  Bottom 0.406: SV4.2 130.81,39.37 131.76,40.32 131.76,43.18 133.67,45.09 137.16,45.09 138.75,46.67 SV14.3
  Bottom 0.61: U$2.D1 SV4.2
ESP_GPIO9
  Bottom 0.61: SV6.3 U$2.SD2
ESP_GPIO10
  Bottom 0.61: SV6.4 U$2.SD3
ESP_GPIO12
  Top 0.305: SV5.2 124.78,21.59 125.41,22.23 125.41,32.07 125.73,32.38 127.64,32.38 128.27,31.75 LED15.A
  Bottom 0.61: U$2.D6 SV5.2
ESP_GPIO13
  Top 0.305: SV5.3 123.83,19.05 125.73,17.14 127.84,17.14 S4.1 S4.2
  Bottom 0.61: U$2.D7 SV5.3
ESP_GPIO14
  Top 0.254: SV5.1 120.02,24.13 119.06,25.08 119.06,44.13 120.02,45.09 121.28,45.09 121.92,45.72 121.92,84.45 122.24,84.77 SV16.3
  Bottom 0.61: U$2.D5 SV5.1
ESP_GPIO15
  Bottom 0.61: U$2.D8 SV5.4
ESP_GPIO16
  Bottom 0.61: U$2.D0 SV4.1
GND
  Top 0.254: R3.1 48.11,21.11 | R14.1 151.13,22.54 151.76,21.91 SV9.1
  Top 0.305: LED9.VSS 86.25,64.88 84.77,66.36 84.77,69.11 LED10.VSS 85.61,71.23 84.77,72.07 84.77,75.45 LED11.VSS 85.61,77.58 84.77,78.42 84.77,81.81 LED12.VSS 85.3,83.93 84.77,84.45 84.77,88.16 LED13.VSS 85.3,90.28 84.77,90.81 84.77,94.5 LED14.VSS | R20.1 128.27,20 128.59,19.68 135.89,19.68 136.84,18.73 136.84,10.16 135.89,9.21 135.57,9.21 R19.1 132.72,9.04 132.72,7.94 131.76,6.99 127,6.99 125.09,8.89 SV5.7
  Top 0.406: SV1.39 5.08,41.91 5.08,46.99 SV1.34 5.08,49.53 5.08,52.07 SV1.30 5.08,54.61 5.08,57.15 SV1.25 5.08,59.69 5.08,64.77 SV1.20 5.08,67.31 5.08,72.39 SV1.14 5.08,74.93 5.08,77.47 SV1.9 | SV1.6 5.08,82.55 1.59,82.55
  Top 0.61: U$1.GND 16.19,87.63 12.38,83.82 SV1.6 | R2.1 32.74,21.72 C1.2 26.04,24.45 25.08,25.4 | R5.1 R6.1 R7.1 R8.1 R9.1 R10.1 R11.1 R12.1 53.49,39.37 61.28,39.37 63.5,41.59 R16.A 63.5,53.34 64.45,54.29 73.98,54.29 75.25,55.56 75.25,91.44 76.83,93.03 81.6,93.03 82.87,94.3 82.87,95.89 83.82,96.84 86.69,96.84 LED14.VSS 86.68,96.86 86.68,97.79 87.31,98.42 95.25,98.42 95.89,97.79 SV2.19 | SV7.6 83.82,19.05 84.45,18.41 84.45,9.84 83.5,8.89 SV7.2 81.15,9.02 C2.2 75.25,18.41 74.61,19.05 65.09,19.05 64.77,19.37 64.77,21.44 R4.1 | SV2.19 SV2.20 SV2.18 | SV2.17 SV2.19 | R14.1 147.47,24.61 146.69,25.4 142.24,25.4 140.65,23.81 140.65,10.79 139.06,9.21 135.57,9.21 | SV1.39 3.81,38.73 6.35,36.2 24.45,36.2 25.08,35.56 25.08,25.4 | R15.A 31.75,6.99 32.7,6.03 38.42,6.03 39.05,6.67 39.05,19.05 39.37,19.37 | IC1.14 8.26,23.18 9.21,22.23 20.32,22.23 20.95,22.86 IC1.9 24.45,24.77 25.08,25.4
  Top 0.813: IC2.1 32.38,97.19 C4.2 C3.2 27.18,97.16 24.77,97.16 23.81,96.2 23.81,94.61 23.18,93.98 5.08,93.98 1.59,90.49 1.59,82.55 1.59,79.69 2.54,78.74 SV1.9 | R2.1 32.87,20.15 33.66,19.37 39.37,19.37 43.5,19.37 45.89,19.37 R3.1 | 48.11,21.11 49.85,19.37 64.77,19.37
  Top 1.016: R10.1 48.26,37.78 46.99,36.51 44.13,36.51 43.18,35.56 43.18,19.68 43.5,19.37
  Bottom 0.61: SV7.6 U$2.GND@0 | SV7.2 U$2.GND@1 109.86,8.89 | SV5.7 U$2.GND@3 109.86,8.89 | SV4.7 U$2.GND@2 110.49,26.67 109.54,25.72 109.54,9.21 109.86,8.89 | SV10.3 156.21,87.31 157.16,86.36 157.16,71.12 154.31,68.26 SV11.4 SV11.3 155.89,62.23 157.16,60.96 157.16,28.57 154.31,25.72 SV9.1 | R15.A 31.75,6.99 30.8,6.03 24.77,6.03 23.81,6.99 23.81,10.48 22.86,11.43 SV3.1
  Bottom 1.27: SV3.15 SV3.13 SV3.11 SV3.9 SV3.7 SV3.5 SV3.3 SV3.1
  pour Top: 0.32,0 160.02,0 160.02,100.01 0,100.01 0,0
  pour Bottom: 0,0 160.02,0 160.02,100.01 0,100.01
GPIO2  (via drill 0.5)
  Top 0.254: v102.87,87.63 102.87,96.52 SV2.15
  Bottom 0.254: SV1.3 3.81,86.68 4.76,87.63 13.34,87.63 14.61,88.9 17.78,88.9 19.05,87.63 v102.87,87.63
GPIO3  (via drill 0.5)
  Top 0.254: v104.14,86.68 SV2.16
  Bottom 0.254: SV1.5 5.08,85.09 13.34,85.09 14.61,86.36 17.78,86.36 19.05,85.09 75.56,85.09 77.15,86.68 v104.14,86.68
GPIO4  (via drill 0.5)
  Top 0.254: v8.57,80.01 v8.57,59.69
  Bottom 0.254: SV1.7 5.08,80.01 v8.57,80.01 | v8.57,59.69 21.59,59.69 26.99,65.09 104.46,65.09 105.41,64.14 143.19,64.14 143.83,63.5 SV14.1
GPIO5  (via drill 0.5)
  Top 0.254: R2.2 35.71,25.12 S1.4 S1.3 31,26.99 28.89,26.99 27.94,27.94 v27.94,52.07
  Bottom 0.254: SV1.29 3.81,53.02 4.76,52.07 v27.94,52.07
GPIO6  (via drill 0.5)
  Top 0.254: S2.3 S2.4 50.95,25.12 R3.2 | v26.99,49.53 v26.99,28.57
  Bottom 0.254: SV1.31 5.08,49.53 v26.99,49.53 | v26.99,28.57 42.86,28.57 44.45,26.99 46.24,26.99 S2.3
GPIO7  (via drill 0.5)
  Top 0.305: v11.43,37.47 11.43,52.7 10.79,53.34 8.89,53.34 8.26,53.98 8.26,56.52 SV1.26
  Bottom 0.305: JP1.8 v11.43,37.47
GPIO8  (via drill 0.5)
  Top 0.254: U$1.CS 9.53,78.11 v9.53,60.96
  Bottom 0.254: v9.53,60.96 SV1.24
GPIO9  (via drill 0.5)
  Top 0.254: U$1.MISO 14.92,68.26 v14.92,64.77
  Top 0.305: JP1.2 3.49,33.02 1.91,34.61 1.91,62.23 3.17,63.5 SV1.21
  Bottom 0.254: v14.92,64.77 5.08,64.77 SV1.21
GPIO10  (via drill 0.5)
  Top 0.254: U$1.MOSI 12.7,73.66 v12.7,67.31
  Bottom 0.254: v12.7,67.31 5.08,67.31 SV1.19
  Bottom 0.305: JP1.6 8.89,34.92 8.57,35.24 4.13,35.24 2.54,36.83 2.54,64.77 SV1.19
GPIO11  (via drill 0.5)
  Top 0.254: U$1.SCK 13.97,72.39 v13.97,62.23
  Top 0.305: JP1.4 6.35,33.66 5.71,34.29 3.81,34.29 2.54,35.56 2.54,60.64 2.86,60.96 SV1.23
  Bottom 0.254: v13.97,62.23 5.08,62.23 SV1.23
GPIO12  (via drill 0.5)
  Top 0.254: v116.52,67.31 116.52,92.71 116.84,93.03 SV2.6 | v41.91,50.8 41.91,54.61 SV8.9
  Top 0.305: SV8.9 v43.18,67.31
  Bottom 0.254: v43.18,67.31 v116.52,67.31 | SV1.32 v41.91,50.8
GPIO13  (via drill 0.5)
  Top 0.254: S3.3 S3.4 67.46,25.12 R4.2 | v28.89,46.99 v28.89,29.84
  Bottom 0.254: SV1.33 5.08,46.99 v28.89,46.99 | v28.89,29.84 58.1,29.84 60.96,26.99 62.75,26.99 S3.3
GPIO14  (via drill 0.5, 0.6)
  Top 0.254: v119.38,57.78 119.38,92.08 120.65,93.34 120.65,96.52 SV2.3 | v35.56,81.28 v35.56,57.78
  Top 0.305: SV8.15 v35.56,57.78
  Bottom 0.254: SV1.8 12.7,81.28 15.24,83.82 17.78,83.82 20.32,81.28 v35.56,81.28
  Bottom 0.305: v35.56,57.78 v119.38,57.78
GPIO15  (via drill 0.5, 0.6)
  Top 0.254: v118.43,58.74 118.43,92.08 119.38,93.03 SV2.4 | v38.1,78.74 v38.1,58.74
  Top 0.305: SV8.13 v38.1,58.74
  Bottom 0.254: v38.1,58.74 v118.43,58.74 | SV1.10 12.38,78.74 14.92,81.28 17.78,81.28 20.32,78.74 v38.1,78.74
GPIO16  (via drill 0.5)
  Top 0.254: v45.72,68.26 SV8.7 44.45,54.61 v44.45,50.8 | v115.57,68.26 115.57,96.52 SV2.7
  Bottom 0.254: v45.72,68.26 v115.57,68.26 | SV1.36 44.45,45.72 v44.45,50.8
GPIO17  (via drill 0.5)
  Top 0.254: v107.95,78.74 107.95,96.52 SV2.11
  Bottom 0.254: SV1.11 5.08,77.47 13.97,77.47 15.24,78.74 17.78,78.74 19.05,77.47 77.15,77.47 78.42,78.74 v107.95,78.74 120.02,78.74 120.65,79.38 120.65,86.04 121.92,87.31 142.56,87.31 143.83,86.04 SV16.1
GPIO18  (via drill 0.6)
  Top 0.305: v82.55,76.2 82.55,55.88 85.72,52.7 SV15.1
  Bottom 0.305: SV1.12 v82.55,76.2
GPIO19  (via drill 0.5)
  Top 0.254: SV2.14 v106.68,66.04 | v25.4,66.04 v25.4,44.45
  Bottom 0.254: v106.68,66.04 v25.4,66.04 | v25.4,44.45 5.08,44.45 SV1.35
GPIO20  (via drill 0.5)
  Top 0.254: v48.26,69.22 SV8.5 46.99,54.61 v46.99,50.8 | v114.62,69.22 114.62,94.93 SV2.8
  Bottom 0.254: v48.26,69.22 v114.62,69.22 | v46.99,50.8 46.99,43.18 SV1.38
GPIO21  (via drill 0.5)
  Top 0.254: v50.8,70.17 SV8.3 49.53,54.61 v49.53,50.8 | v113.67,70.17 113.67,93.66 113.03,94.3 113.03,96.84 112.08,97.79 SV2.9
  Bottom 0.254: v50.8,70.17 v113.67,70.17 | SV1.40 49.53,40.64 v49.53,50.8
GPIO22  (via drill 0.5)
  Top 0.254: v105.41,72.39 105.41,96.52 SV2.13 | v133.67,72.71 133.67,40.96
  Top 0.305: 133.67,40.96 134.3,40.32 141.92,40.32 142.88,39.37 SV13.3
  Bottom 0.254: SV1.15 5.08,72.39 13.97,72.39 15.24,71.12 17.78,71.12 19.05,72.39 v105.41,72.39 111.12,72.39 111.44,72.71 v133.67,72.71
GPIO23  (via drill 0.5)
  Top 0.254: v117.47,59.69 117.47,92.39 118.11,93.03 118.11,96.52 SV2.5 | v40.64,70.8 v40.64,59.69
  Top 0.305: SV8.11 v40.64,59.69
  Bottom 0.254: v40.64,59.69 v117.47,59.69 | SV1.16 7.62,71.12 7.94,70.8 13.02,70.8 15.56,68.26 17.78,68.26 20.32,70.8 v40.64,70.8
GPIO24  (via drill 0.5)
  Top 0.254: U$1.DC 11.43,74.93 v11.43,68.58
  Bottom 0.254: v11.43,68.58 SV1.18
GPIO25  (via drill 0.5)
  Top 0.254: U$1.RST 10.48,76.52 v10.48,63.5
  Bottom 0.254: v10.48,63.5 SV1.22
GPIO26  (via drill 0.5)
  Top 0.254: v53.34,71.44 SV8.1 52.07,54.61 v52.07,50.8 | v112.71,71.44 112.71,93.34 111.76,94.3 SV2.10
  Bottom 0.254: v53.34,71.44 v112.71,71.44 | v52.07,50.8 52.07,39.37 51.44,38.73 6.03,38.73 5.08,39.69 5.08,41.91 SV1.37
GPIO27  (via drill 0.5)
  Top 0.254: v109.22,73.66 SV2.12 | v135.25,73.66 135.25,42.55
  Top 0.305: 135.25,42.55 135.25,42.23 136.21,41.27 142.56,41.27 143.83,40.01 143.83,34.61 144.78,33.66 144.78,28.89 144.15,28.26 SV12.3
  Bottom 0.254: SV1.13 5.08,74.93 7.94,74.93 9.21,73.66 v109.22,73.66 v135.25,73.66
N$1
  Top 0.406: U$1.LED 16.66,72.54
  Top 0.61: 16.66,72.54 20.32,72.54 R1.1
N$2
  Top 0.305: IC1.12 13.34,27.3 12.7,27.94 4.45,27.94 3.81,28.57 JP1.1
N$3
  Bottom 0.305: IC1.13 10.79,27.3 10.16,27.94 7.3,27.94 6.35,28.89 JP1.3
N$4
  Bottom 0.305: JP1.5 8.89,30.16 9.84,29.21 15.24,29.21 15.88,28.57 IC1.11
N$5
  Bottom 0.305: IC1.10 18.41,29.53 17.46,30.48 JP1.7
N$6
  Top 0.406: SV3.16 4.45,10.16 4.45,12.38 3.17,13.65 IC1.1
  Top 0.61: JP2.1 24.45,11.43 23.81,10.79 23.81,7.94 22.86,6.99 3.81,6.99 3.17,7.62 SV3.16
N$7
  Top 0.406: SV3.14 6.99,10.16 6.99,12.38 5.71,13.65 IC1.2
N$8
  Top 0.406: SV3.12 9.53,10.16 9.53,12.38 8.26,13.65 IC1.3
N$9
  Top 0.406: SV3.10 12.06,10.16 12.06,12.38 10.79,13.65 IC1.4
N$10
  Top 0.406: SV3.8 14.61,10.16 14.61,12.38 13.34,13.65 IC1.5
N$11
  Top 0.406: SV3.6 17.14,10.16 17.14,12.38 15.88,13.65 IC1.6
N$12
  Top 0.406: SV3.4 19.68,10.16 19.68,12.7 18.41,13.97 IC1.7
N$13
  Top 0.406: SV3.2 22.23,10.16 22.23,12.7 20.95,13.97 IC1.8
N$14
  Top 0.406: LED1.A SV8.16
N$15
  Top 0.406: R5.2 LED1.C
N$16
  Top 0.406: LED2.A SV8.14
N$17
  Top 0.406: R6.2 LED2.C
N$18
  Top 0.406: LED3.A SV8.12
N$19
  Top 0.406: R7.2 LED3.C
N$20
  Top 0.406: LED4.A SV8.10
N$21
  Top 0.406: R8.2 LED4.C
N$22
  Top 0.406: LED5.A SV8.8
N$23
  Top 0.406: R9.2 LED5.C
N$24
  Top 0.406: LED6.A SV8.6
N$25
  Top 0.406: R10.2 LED6.C
N$26
  Top 0.406: LED7.A SV8.4
N$27
  Top 0.406: R11.2 LED7.C
N$28
  Top 0.406: LED8.A SV8.2
N$29
  Top 0.406: R12.2 LED8.C
N$30
  Bottom 0.61: U$2.AD0 SV6.7 JP8.2
N$31
  Bottom 0.61: SV6.6 U$2.RSV@0
N$32
  Bottom 0.61: SV6.5 U$2.RSV@1
N$33
  Top 0.305: LED15.C R20.2
N$34
  Top 0.305: S4.4 S4.3 127.88,11.04 R19.2
N$35
  Bottom 0.61: SV6.2 U$2.SD1
N$36
  Bottom 0.61: SV6.1 U$2.CMD
N$37
  Bottom 0.61: SV7.8 U$2.SD0
N$38
  Bottom 0.61: SV7.7 U$2.CLK
N$39
  Top 0.305: LED13.DOUT 90.9,90.71 89.85,91.76 88.38,91.76 LED14.DIN
N$40
  Bottom 0.61: SV7.5 U$2.3V3@0
N$41
  Bottom 0.61: SV7.4 U$2.EN
N$42
  Bottom 0.61: SV7.3 U$2.RST
N$43
  Top 0.305: LED9.DOUT 90.69,64.88 89.22,66.36 88.38,66.36 LED10.DIN
N$44
  Top 0.305: LED10.DOUT 90.9,71.34 89.53,72.71 88.38,72.71 LED11.DIN
N$50
  Bottom 0.61: U$2.3V3@1 SV4.6
N$59
  Bottom 0.61: U$2.3V3@2 SV5.8
N$60
  Top 0.305: LED11.DOUT 90.9,78.01 89.85,79.06 88.38,79.06 LED12.DIN
N$61
  Top 0.305: LED12.DOUT 90.9,84.36 89.85,85.41 88.38,85.41 LED13.DIN
N$62  (via drill 0.5)
  Top 0.254: R13.1 R14.2
  Top 0.305: v142.24,22.54 R14.2
  Bottom 0.305: SV13.2 140.34,31.43 141.6,30.16 141.6,23.18 v142.24,22.54
N$63
  Top 0.254: SV9.2 R13.2
N$64
  Bottom 0.254: SV9.3 140.34,16.83 SV12.2
N$65
  Bottom 0.61: JP2.2 29.21,8.89 29.53,9.21 29.53,13.02 30.48,13.97 R15.S
N$66
  Bottom 0.254: SV10.1 141.92,82.23 141.29,82.87 SV16.2
N$67
  Top 0.305: SV15.2 89.53,54.29 87,56.83 87,61.39 LED9.DIN
N$68
  Top 0.406: SV14.2 141.29,65.89 R17.2
  Bottom 0.254: SV11.2 148.91,59.69 147.96,58.74 141.92,58.74 141.29,59.37 SV14.2
N$69
  Top 0.61: R16.E 68.58,38.42 67.94,37.78 R18.1
N$70
  Top 0.61: R16.S 69.85,46.99 71.12,45.72 71.12,42.86 72.07,41.91 JP8.1

### Text on the board
tValues: +5V | +3,3V | RPi | GND | +5V | DATA | ESP8266 | 433MHz Transmitter | RPi | GND | GND | Data | ESP8266 | +3,3V | 6 x RGB-LED / WS2812B | RPi | 1-Wire Sensor / DS18b20 / DHT11 / DHT22 | ESP8266 | 0V | +1V / +3,3V | ESP8266 | RPi | GND | ECHO | TRIG | 8 x GND | +5V | HC-SR04 / Ultrasonic | 0V | +3,3V | IoT - EvaluationBoard / V1.0 / 2017 / HTL Saalfelden | CH1 | CH2 | CH3 | CH4 | CH5 | CH6 | CH7 | CH0 / Poti